# EAGLE design vibe-controller (EAGLE 9.6.2)
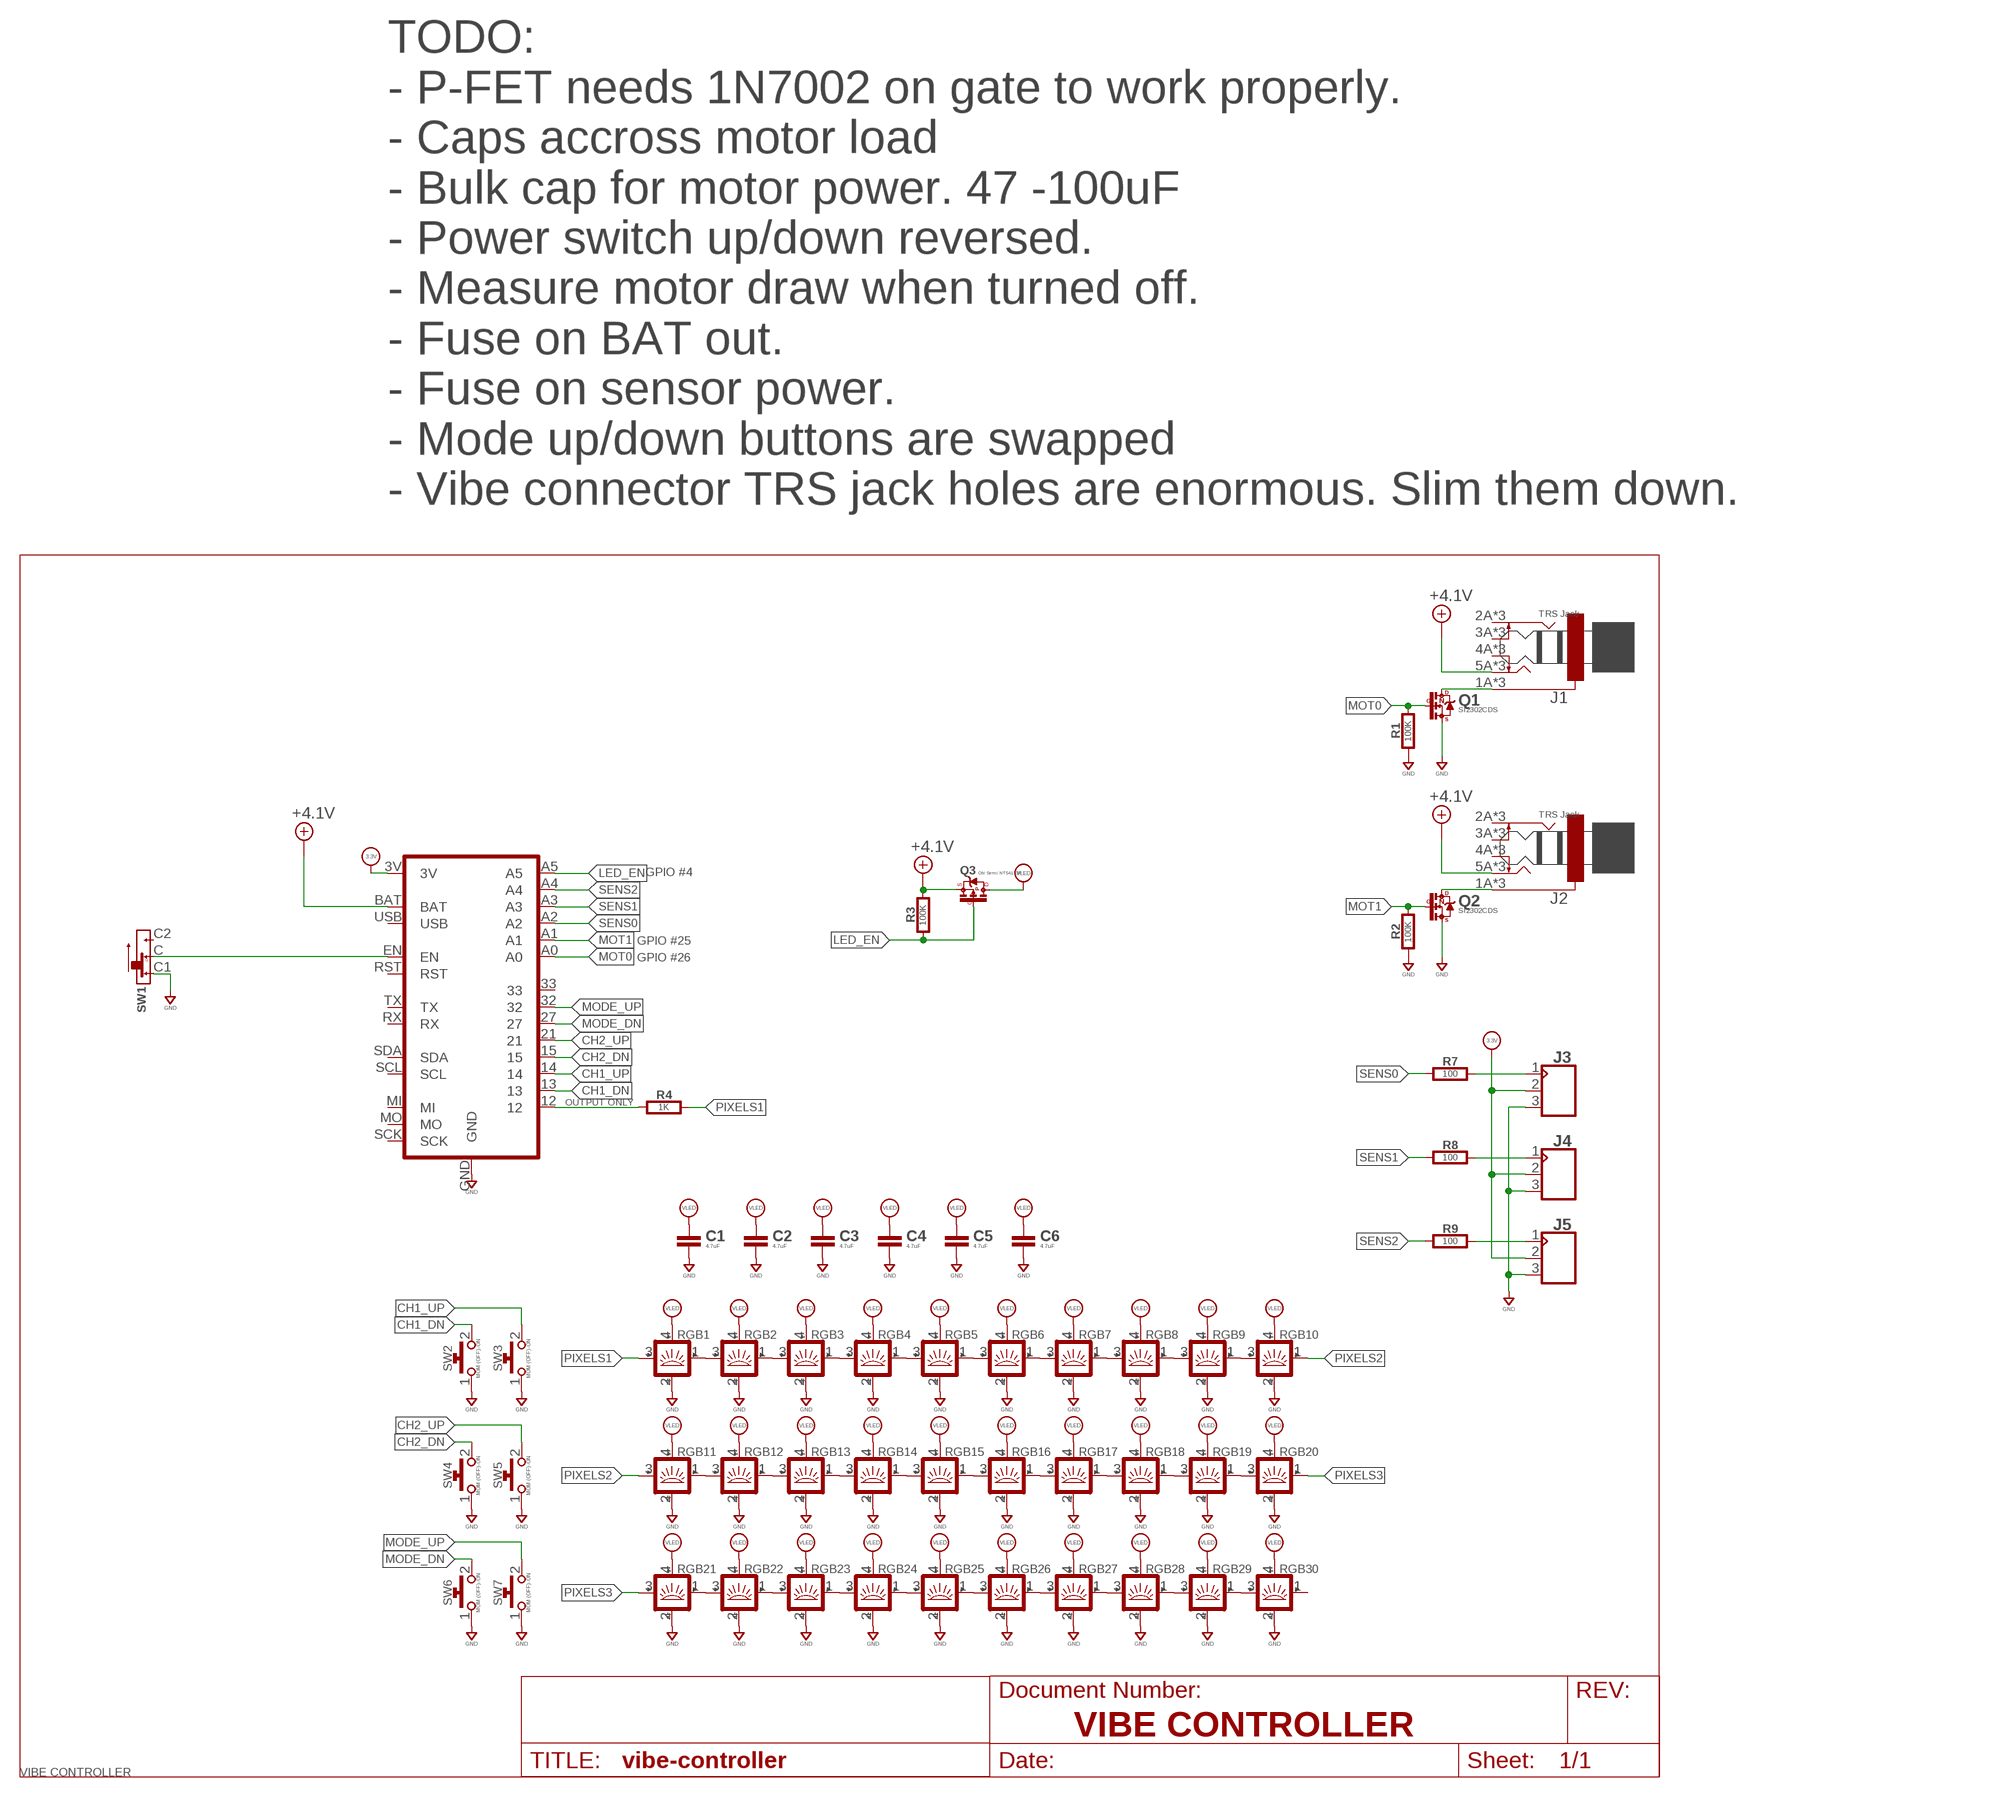
[diagram p0: schematic, sheet 1]
FRAME1 (LETTER_L): DOCUMENT_NUMBER: VIBE CONTROLLER

## Parts
C1  4.7uF  CAPACITOR0603  [0603-CAP]
C2  4.7uF  CAPACITOR0603  [0603-CAP]
C3  4.7uF  CAPACITOR0603  [0603-CAP]
C4  4.7uF  CAPACITOR0603  [0603-CAP]
C5  4.7uF  CAPACITOR0603  [0603-CAP]
C6  4.7uF  CAPACITOR0603  [0603-CAP]
HUZ1  HUZZAHHUZZAH  [ADAFRUIT_HUZZAH32]
J1  TRS Jack  TRS-JACK-STEREOPJ-324  [PJ-324]
J2  TRS Jack  TRS-JACK-STEREOPJ-324  [PJ-324]
J3  CON_03X1-2.54MM-THD-RA  [MA03X1-RA-THD]
J4  CON_03X1-2.54MM-THD-RA  [MA03X1-RA-THD]
J5  CON_03X1-2.54MM-THD-RA  [MA03X1-RA-THD]
Q1  SI2302CDS  N-FET_SI2302  [SOT-23]
Q2  SI2302CDS  N-FET_SI2302  [SOT-23]
Q3  ON Semi NTS4173P  P-FETSOT-323  [SOT-323]
R1  100K  RESISTOR0603  [0603-RES]
R2  100K  RESISTOR0603  [0603-RES]
R3  100K  RESISTOR0603  [0603-RES]
R4  1K  RESISTOR0603  [0603-RES]
R7  100  RESISTOR0603  [0603-RES]
R8  100  RESISTOR0603  [0603-RES]
R9  100  RESISTOR0603  [0603-RES]
RGB1  SMART_LED3535  [SMD_3535]
RGB2  SMART_LED3535  [SMD_3535]
RGB3  SMART_LED3535  [SMD_3535]
RGB4  SMART_LED3535  [SMD_3535]
RGB5  SMART_LED3535  [SMD_3535]
RGB6  SMART_LED3535  [SMD_3535]
RGB7  SMART_LED3535  [SMD_3535]
RGB8  SMART_LED3535  [SMD_3535]
RGB9  SMART_LED3535  [SMD_3535]
RGB10  SMART_LED3535  [SMD_3535]
RGB11  SMART_LED3535  [SMD_3535]
RGB12  SMART_LED3535  [SMD_3535]
RGB13  SMART_LED3535  [SMD_3535]
RGB14  SMART_LED3535  [SMD_3535]
RGB15  SMART_LED3535  [SMD_3535]
RGB16  SMART_LED3535  [SMD_3535]
RGB17  SMART_LED3535  [SMD_3535]
RGB18  SMART_LED3535  [SMD_3535]
RGB19  SMART_LED3535  [SMD_3535]
RGB20  SMART_LED3535  [SMD_3535]
RGB21  SMART_LED3535  [SMD_3535]
RGB22  SMART_LED3535  [SMD_3535]
RGB23  SMART_LED3535  [SMD_3535]
RGB24  SMART_LED3535  [SMD_3535]
RGB25  SMART_LED3535  [SMD_3535]
RGB26  SMART_LED3535  [SMD_3535]
RGB27  SMART_LED3535  [SMD_3535]
RGB28  SMART_LED3535  [SMD_3535]
RGB29  SMART_LED3535  [SMD_3535]
RGB30  SMART_LED3535  [SMD_3535]
SW1  SLIDE-SPDT-SSSS  [ALPS_SSSS810701]
SW2  MOM (OFF)-ON  TACTILE-2PSMD  [SWITCH-0635-2P-SMD]
SW3  MOM (OFF)-ON  TACTILE-2PSMD  [SWITCH-0635-2P-SMD]
SW4  MOM (OFF)-ON  TACTILE-2PSMD  [SWITCH-0635-2P-SMD]
SW5  MOM (OFF)-ON  TACTILE-2PSMD  [SWITCH-0635-2P-SMD]
SW6  MOM (OFF)-ON  TACTILE-2PSMD  [SWITCH-0635-2P-SMD]
SW7  MOM (OFF)-ON  TACTILE-2PSMD  [SWITCH-0635-2P-SMD]

## Nets
+3.3V: HUZ1.3V J3.2 J4.2 J5.2 ; supply symbol labelled 3.3V
+4.1V: HUZ1.BAT J1.5A1(T) J1.5A2(T) J1.5A(T) J2.5A1(T) J2.5A2(T) J2.5A(T) Q3.2(S) R3.2
CH1_DN: HUZ1.13 SW2.2
CH1_UP: HUZ1.14 SW3.2
CH2_DN: HUZ1.15 SW4.2
CH2_UP: HUZ1.21 SW5.2
GND: C1.2 C2.2 C3.2 C4.2 C5.2 C6.2 HUZ1.GND J3.3 J4.3 J5.3 Q1.2(S) Q2.2(S) R1.1 R2.1 RGB1.2(GND) RGB2.2(GND) RGB3.2(GND) RGB4.2(GND) RGB5.2(GND) RGB6.2(GND) RGB7.2(GND) RGB8.2(GND) RGB9.2(GND) RGB10.2(GND) RGB11.2(GND) RGB12.2(GND) RGB13.2(GND) RGB14.2(GND) RGB15.2(GND) RGB16.2(GND) RGB17.2(GND) RGB18.2(GND) RGB19.2(GND) RGB20.2(GND) RGB21.2(GND) RGB22.2(GND) RGB23.2(GND) RGB24.2(GND) RGB25.2(GND) RGB26.2(GND) RGB27.2(GND) RGB28.2(GND) RGB29.2(GND) RGB30.2(GND) SW1.C1 SW2.1 SW3.1 SW4.1 SW5.1 SW6.1 SW7.1
LED_EN: HUZ1.A5 Q3.1(G) R3.1
MODE_DN: HUZ1.27 SW6.2
MODE_UP: HUZ1.32 SW7.2
MOT0: HUZ1.A0 Q1.1(G) R1.2
MOT1: HUZ1.A1 Q2.1(G) R2.2
N$1: HUZ1.EN SW1.C
N$2: J1.1A1(S) J1.1A2(S) J1.1A(S) Q1.3(D)
N$4: J2.1A1(S) J2.1A2(S) J2.1A(S) Q2.3(D)
N$5: RGB11.1(OUT) RGB12.3(IN)
N$6: RGB1.1(OUT) RGB2.3(IN)
N$7: RGB2.1(OUT) RGB3.3(IN)
N$8: RGB3.1(OUT) RGB4.3(IN)
N$9: RGB4.1(OUT) RGB5.3(IN)
N$10: RGB5.1(OUT) RGB6.3(IN)
N$11: RGB6.1(OUT) RGB7.3(IN)
N$12: RGB7.1(OUT) RGB8.3(IN)
N$13: RGB8.1(OUT) RGB9.3(IN)
N$14: RGB9.1(OUT) RGB10.3(IN)
N$15: RGB12.1(OUT) RGB13.3(IN)
N$16: RGB13.1(OUT) RGB14.3(IN)
N$17: RGB14.1(OUT) RGB15.3(IN)
N$18: RGB15.1(OUT) RGB16.3(IN)
N$19: RGB16.1(OUT) RGB17.3(IN)
N$20: RGB17.1(OUT) RGB18.3(IN)
N$21: RGB18.1(OUT) RGB19.3(IN)
N$22: RGB19.1(OUT) RGB20.3(IN)
N$23: RGB21.1(OUT) RGB22.3(IN)
N$24: RGB22.1(OUT) RGB23.3(IN)
N$25: RGB23.1(OUT) RGB24.3(IN)
N$26: RGB24.1(OUT) RGB25.3(IN)
N$27: RGB25.1(OUT) RGB26.3(IN)
N$28: RGB26.1(OUT) RGB27.3(IN)
N$29: RGB27.1(OUT) RGB28.3(IN)
N$30: RGB28.1(OUT) RGB29.3(IN)
N$31: RGB29.1(OUT) RGB30.3(IN)
N$32: HUZ1.12 R4.1
N$35: J3.1 R7.2
N$36: J4.1 R8.2
N$37: J5.1 R9.2
PIXELS1: R4.2 RGB1.3(IN)
PIXELS2: RGB10.1(OUT) RGB11.3(IN)
PIXELS3: RGB20.1(OUT) RGB21.3(IN)
SENS0: HUZ1.A2 R7.1
SENS1: HUZ1.A3 R8.1
SENS2: HUZ1.A4 R9.1
VLED: C1.1 C2.1 C3.1 C4.1 C5.1 C6.1 Q3.3(D) RGB1.4(VDD) RGB2.4(VDD) RGB3.4(VDD) RGB4.4(VDD) RGB5.4(VDD) RGB6.4(VDD) RGB7.4(VDD) RGB8.4(VDD) RGB9.4(VDD) RGB10.4(VDD) RGB11.4(VDD) RGB12.4(VDD) RGB13.4(VDD) RGB14.4(VDD) RGB15.4(VDD) RGB16.4(VDD) RGB17.4(VDD) RGB18.4(VDD) RGB19.4(VDD) RGB20.4(VDD) RGB21.4(VDD) RGB22.4(VDD) RGB23.4(VDD) RGB24.4(VDD) RGB25.4(VDD) RGB26.4(VDD) RGB27.4(VDD) RGB28.4(VDD) RGB29.4(VDD) RGB30.4(VDD)
Unconnected: HUZ1.33 HUZ1.MI HUZ1.MO HUZ1.RST HUZ1.RX HUZ1.SCK HUZ1.SCL HUZ1.SDA HUZ1.TX HUZ1.USB J1.2A1(R) J1.2A2(R) J1.2A(R) J1.3A1(RN) J1.3A2(RN) J1.3A(RN) J1.4A1(TN) J1.4A2(TN) J1.4A(TN) J2.2A1(R) J2.2A2(R) J2.2A(R) J2.3A1(RN) J2.3A2(RN) J2.3A(RN) J2.4A1(TN) J2.4A2(TN) J2.4A(TN) RGB30.1(OUT) SW1.C2

## Notes on the sheet
- TODO:
  - P-FET needs 1N7002 on gate to work properly.
  - Caps accross motor load
  - Bulk cap for motor power. 47 -100uF
  - Power switch up/down reversed.
  - Measure motor draw when turned off.
  - Fuse on BAT out.
  - Fuse on sensor power.
  - Mode up/down buttons are swapped
  - Vibe connector TRS jack holes are enormous. Slim them down.
- GPIO #4
- GPIO #25
- GPIO #26
- OUTPUT ONLY

## Library data of the parts
C1-C6 = rlc:CAPACITOR: Capacitor
HUZ1 = co-espressif:HUZZAH: AdaFruit Huzzah32
J1 J2 = con-trs:TRS-JACK-STEREO: TRS Jack; COST01: 0.18; COST10: 0.18; COST100: 0.18; MFR: Tayda; MPN: A-4780
J3-J5 = con-headers:CON_03X1: Header, 3-pin, single row
Q1 Q2 = transistor-fet:N-FET: FET
Q3 = transistor-fet:P-FET: P-FET (PFET)
R1-R4 R7-R9 = rlc:RESISTOR: Resistor
RGB1-RGB30 = led:SMART_LED: Smart LED SK6812 WS2812
SW1 = switch-smd:SLIDE-SPDT: Slide Switch - SPDT; MFR: Alps; MPN: SSSS810701
SW2-SW7 = switch-smd:TACTILE-2P: Tactile Push Switch; MFR: CK Switch; MPN: PTS635S*SMTR; MPN2: Pololu #1400

## Board
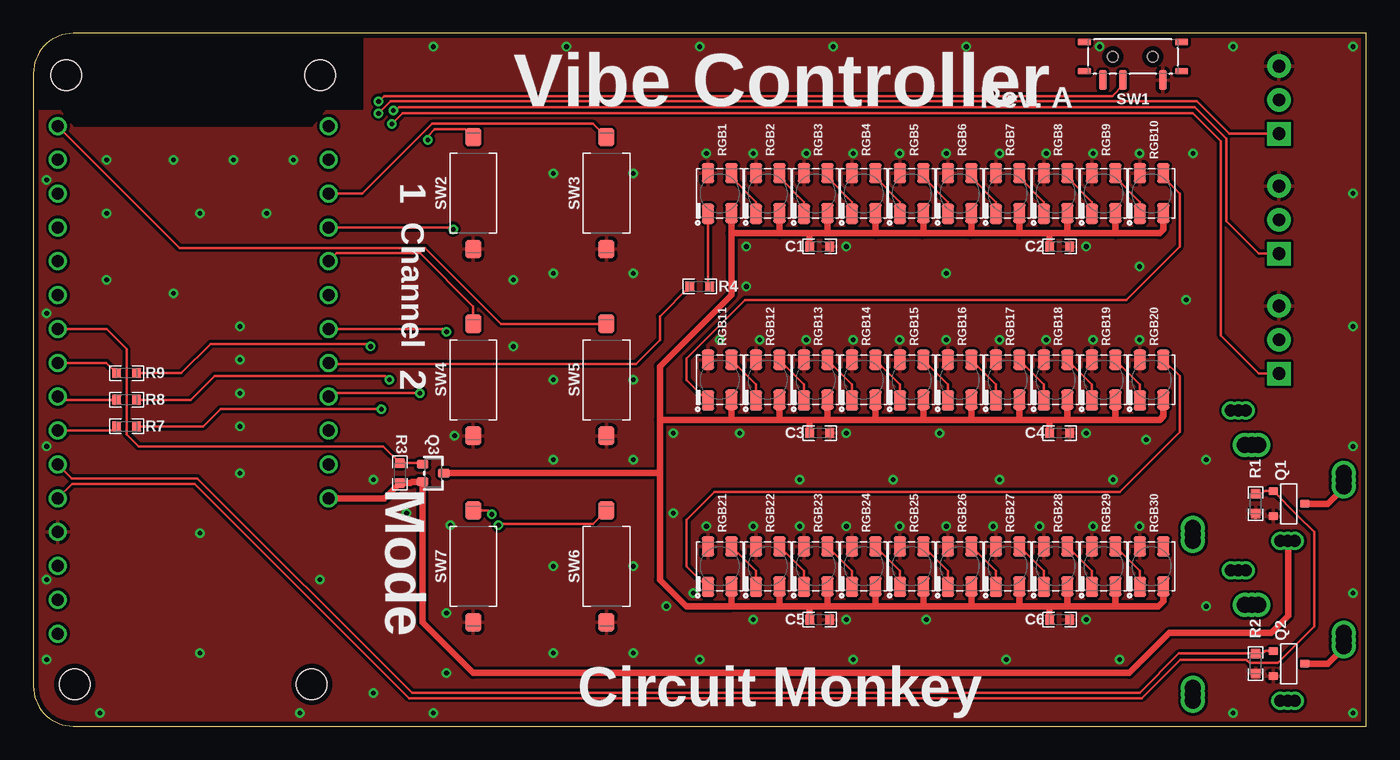
[diagram p1: board, top side]
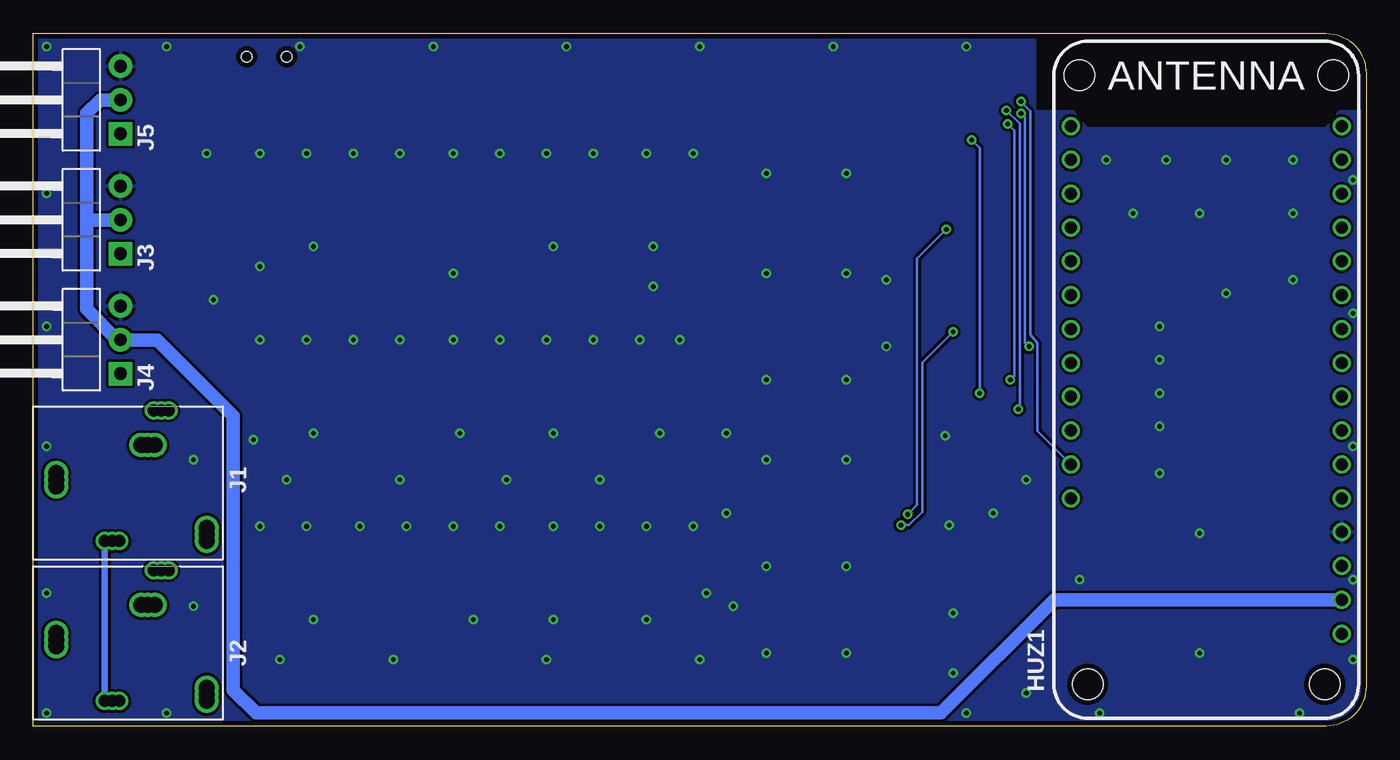
[diagram p2: board, bottom side, seen from below]

Size 100 x 52 mm. Coordinates in mm from the lower left corner, seen from the top.
Outline: 3,0 100,0 100,52 3,52 arc90 0,49 0,3 arc90 3,0
Copper layers (1*16): Top 0.0356mm / dielectric 1.5011mm / Bottom 0.0356mm
Design rules "OSH-CircuitMonkey *": minimum track width 6mil, minimum drill 13mil, track to track 0.2mm, track to pad 6mil, pad to pad 6mil, via to via 6mil, smd to smd 6mil, copper to edge 15mil, drill to drill 6mil, minimum pad ring 7mil, minimum via ring 7mil, stop-mask expansion 3mil, vias tented up to drill 13mil, thermal gap 10mil

### Footprints (pad centres in the part's own frame; a part is rotated, then mirrored left to right if it is on the bottom)
0603-CAP = smd 0.711 x 0.762: 1 -0.752,0; 2 0.752,0
ADAFRUIT_HUZZAH32 = drill 0.9: 3V -16.51,-10.16; 12 1.27,10.16; 13 -1.27,10.16; 14 13.97,10.16; 15 8.89,10.16; 21 19.05,-10.16; 27 3.81,10.16; 32 11.43,10.16; 33 6.35,10.16; A0 -8.89,-10.16; A1 -6.35,-10.16; A2 -3.81,-10.16; A3 -1.27,-10.16; A4 1.27,-10.16; A5 3.81,-10.16; BAT -8.89,10.16; EN -6.35,10.16; GND -11.43,-10.16; MI 11.43,-10.16; MO 8.89,-10.16; NC -13.97,-10.16; RST -19.05,-10.16; RX 13.97,-10.16; SCK 6.35,-10.16; SCL 16.51,10.16; SDA 19.05,10.16; TX 16.51,-10.16; USB -3.81,10.16 | hole 2.286: -22.86,8.89; 22.86,9.525; 22.86,-9.525; -22.86,-8.89
PJ-324 = drill 1.2: 1A 0,-1.7; 1A1 -0.5,-1.7; 1A2 0.5,-1.7; 3A 2.6,-8.6; 3A1 2.6,-8.1; 3A2 2.6,-9.1; 4A -4.1,-13; 4A1 -4.6,-13; 4A2 -3.6,-13 | drill 0.9: 2A 5.2,-9.6; 2A1 5.2,-9.05; 2A2 5.2,-10.15; 5A -4.6,-5.9; 5A1 -4.6,-5.35; 5A2 -4.6,-6.45
MA03X1-RA-THD = drill 0.965 pad 1.778 square: 1 -2.54,-2.54 | drill 0.965 pad 1.778: 2 0,-2.54; 3 2.54,-2.54
SOT-23 = smd 0.6 x 0.7: 1 -0.95,-1.18; 2 0.95,-1.18; 3 0,1.18
SOT-323 = smd 0.7 x 0.9: 1 -0.65,-0.8; 2 0.65,-0.8; 3 0,0.8
0603-RES = smd 0.711 x 0.762: 1 -0.752,0; 2 0.752,0
SMD_3535 = smd 1.5 x 0.9: 1 -1.5,0.875; 2 -1.5,-0.875; 3 1.55,-0.875; 4 1.5,0.875
ALPS_SSSS810701 = smd 0.6 x 1.5: C 0.75,1.75; C1 -2.25,1.75; C2 2.25,1.75 | smd 1 x 0.5: MT1 -3.65,-1.1; MT2 -3.65,1.1; MT3 3.65,1.1; MT4 3.65,-1.1 | hole 0.8: -1.5,0; 1.5,0
SWITCH-0635-2P-SMD = smd 1.4 x 1.2: 1 -4.2,0; 2 4.2,0

### Placement (x,y rotation side)
C1  59,36 0 top
C2  77,36 0 top
C3  59,22 0 top
C4  77,22 0 top
C5  59,8 0 top
C6  77,8 0 top
HUZ1  12,26 90 bottom
J1  100,18.5 90 bottom
J2  100,6.5 90 bottom
J3  96,38 90 bottom
J4  96,29 90 bottom
J5  96,47 90 bottom
Q1  94.2,16.7 270 top
Q2  94.2,4.7 270 top
Q3  30,19 270 top
R1  91.7,16.7 90 top
R2  91.7,4.7 90 top
R3  27.5,19 270 top
R4  50,33 0 top
R7  7,22.5 0 top
R8  7,24.5 0 top
R9  7,26.5 0 top
RGB1  51.5,40 270 top
RGB2  55.1,40 270 top
RGB3  58.7,40 270 top
RGB4  62.3,40 270 top
RGB5  65.9,40 270 top
RGB6  69.5,40 270 top
RGB7  73.1,40 270 top
RGB8  76.7,40 270 top
RGB9  80.3,40 270 top
RGB10  83.9,40 270 top
RGB11  51.5,26 270 top
RGB12  55.1,26 270 top
RGB13  58.7,26 270 top
RGB14  62.3,26 270 top
RGB15  65.9,26 270 top
RGB16  69.5,26 270 top
RGB17  73.1,26 270 top
RGB18  76.7,26 270 top
RGB19  80.3,26 270 top
RGB20  83.9,26 270 top
RGB21  51.5,12 270 top
RGB22  55.1,12 270 top
RGB23  58.7,12 270 top
RGB24  62.3,12 270 top
RGB25  65.9,12 270 top
RGB26  69.5,12 270 top
RGB27  73.1,12 270 top
RGB28  76.7,12 270 top
RGB29  80.3,12 270 top
RGB30  83.9,12 270 top
SW1  82.5,50.25 180 top
SW2  33,40 90 top
SW3  43,40 90 top
SW4  33,26 90 top
SW5  43,26 90 top
SW6  43,12 90 top
SW7  33,12 90 top

### Tracks (layer width: path | path; a pad name or v marks a point on that pad's centre or on a via)
+3.3V
  Bottom 1: HUZ1.3V 23.41,9.49 31.9,1 83.3,1 85,2.7 85,23.3 90.7,29 J4.2 93.7,29 96,31.3 96,38 | J3.2 96,38 | J5.2 95,47 96,46 96,38
+4.1V
  Top 0.5: HUZ1.BAT 26.36,17.11 R3.2 28.3,18.25 28.4,18.35 Q3.2 29.2,7.8 33,4 82.22,4 85.22,7 92.88,7 94.15,8.28 94.15,13.9 J1.5A1 J1.5A2 J1.5A
  Bottom 0.5: J1.5A1 94.65,2.45 J2.5A | J2.5A J2.5A1 | J2.5A J2.5A2
CH1_DN  (via drill 0.35)
  Top 0.2: HUZ1.13 22.43,25 v29,25 | v29.6,44 29.6,44.3 30.1,44.8 32.4,44.8 SW2.2
  Bottom 0.2: v29,25 29,43.4 v29.6,44
CH1_UP
  Top 0.2: SW3.2 42,45.2 29.9,45.2 24.67,39.97 HUZ1.14
CH2_DN
  Top 0.2: SW4.2 33,31.49 29,35.49 22.76,35.49 HUZ1.15
CH2_UP
  Top 0.2: SW5.2 35.1,30.2 29.4,35.9 10.99,35.9 HUZ1.21
GND  (via drill 0.35)
  other vias: 99,1 90,1 99,10 99,21 99,30 99,40 99,51 90,51 80,51 70,51 60,51 50,51 40,51 30,51 1,31 1,41 1,21 1,11 1,5 5,1 20,1 30,1 50.5,43 54,43 58,43 61.5,43 65,43 68.5,43 72.5,43 76,43 79.5,43 83,43 79,36 83,34.5 61,36 68.5,34 53.5,36 53.5,33 51.5,29 54.5,29 58,29 61.5,29 65,29 68.5,29 72.5,29 76,29 79.5,29 83,29 79,22 83.5,21.5 81,18.5 72.5,18.5 68,22 64.5,18.5 61,22 57.5,18.5 53,22 48,22 48,16 49.5,10 50.5,15 54,15 57.5,15 61,15 65,15 68.5,15 72,15 75.5,15 79.5,15 83,15 61,8 79,8 81.5,5 88,9 73,5 67,8 61.5,5 54,8 50,5 47.5,9 45,5.5 39,5.5 45,12 39,12 45,20 39,20 45,26 39,26 45,34 39,34 36,28.5 36,33.5 45,41.5 39,41.5 31.6,21.8 31.3,15.1 31,8.5 28,16 25.5,18.5 31,4 25.5,2.5 15.5,19 15.5,22.5 15.5,25 15.5,27.5 15.5,30 17.5,38.5 12.5,38.5 15,42.5 5.5,42.5 10.5,42.5 19.5,42.5 5.5,38.5 5.5,33.5 10.5,32.5 86.5,32 88,20 87,43 12.5,5.5 12.5,14.5 21.5,11
  pour Bottom: 0,0 100,0 100,52 0,52
  pour Top: 0,0 100,0 100,52 0,52
LED_EN
  Top 0.2: Q3.1 29.1,19.75 R3.1 26.25,21 7.9,21 7,21.9 7,28.3 5.49,29.81 HUZ1.A5
MODE_DN  (via drill 0.35)
  Top 0.2: HUZ1.27 30.79,29.81 v31,29.6 | v34.9,15.1 35,15.2 42,15.2 SW6.2
  Bottom 0.2: v31,29.6 33.3,27.3 33.3,16.1 34.3,15.1 v34.9,15.1
MODE_UP  (via drill 0.35)
  Top 0.2: HUZ1.32 31.37,37.43 v31.5,37.3 | v34.4,15.9 34.1,16.2 SW7.2
  Bottom 0.2: v31.5,37.3 33.7,35.1 33.7,16.6 v34.4,15.9
MOT0
  Top 0.2: R1.2 92.2,17.45 92.4,17.65 Q1.1 94.83,15.84 96.1,14.57 96.1,7.48 93.37,4.74 91.26,4.74 91,5 86.07,5 83.17,2.1 28.2,2.1 12.1,18.2 2.9,18.2 1.84,17.14 HUZ1.A0
MOT1
  Top 0.2: Q2.1 92.42,5.65 92.22,5.45 R2.2 85.95,5.45 83,2.5 28.4,2.5 12.3,18.6 2.89,18.6 HUZ1.A1
N$1  (via drill 0.35)
  Top 0.2: SW1.C 81.75,48.1 80.95,47.3 26.3,47.3 v25.9,46.9
  Bottom 0.2: HUZ1.EN 24.66,22.15 24.66,28.75 25.2,29.39 25.2,46.16 25.9,46.87 v25.9,46.9
N$2
  Top 0.5: Q1.3 97.1,16.7 98.3,17.9 J1.1A1 J1.1A J1.1A2
N$4
  Top 0.5: J2.1A 98.3,5.9 97.1,4.7 Q2.3 | J2.1A J2.1A1 | J2.1A J2.1A2
N$5
  Top 0.2: RGB11.1 54.23,25.65 RGB12.3
N$6
  Top 0.2: RGB1.1 52.38,41.2 54.23,39.35 RGB2.3
N$7
  Top 0.2: RGB2.1 55.98,41.2 57.83,39.35 RGB3.3
N$8
  Top 0.2: RGB3.1 59.58,41.2 61.42,39.35 RGB4.3
N$9
  Top 0.2: RGB4.1 63.17,41.2 65.03,39.35 RGB5.3
N$10
  Top 0.2: RGB5.1 66.78,41.2 68.62,39.35 RGB6.3
N$11
  Top 0.2: RGB6.1 70.38,41.2 72.22,39.35 RGB7.3
N$12
  Top 0.2: RGB7.1 73.97,41.2 75.83,39.35 RGB8.3
N$13
  Top 0.2: RGB8.1 77.58,41.2 79.42,39.35 RGB9.3
N$14
  Top 0.2: RGB9.1 81.17,41.2 83.03,39.35 RGB10.3
N$15
  Top 0.2: RGB12.1 57.83,25.65 RGB13.3
N$16
  Top 0.2: RGB13.1 61.42,25.65 RGB14.3
N$17
  Top 0.2: RGB14.1 65.03,25.65 RGB15.3
N$18
  Top 0.2: RGB15.1 68.62,25.65 RGB16.3
N$19
  Top 0.2: RGB16.1 72.22,25.65 RGB17.3
N$20
  Top 0.2: RGB17.1 75.83,25.65 RGB18.3
N$21
  Top 0.2: RGB18.1 79.42,25.65 RGB19.3
N$22
  Top 0.2: RGB19.1 83.03,25.65 RGB20.3
N$23
  Top 0.2: RGB21.1 54.23,11.65 RGB22.3
N$24
  Top 0.2: RGB22.1 57.83,11.65 RGB23.3
N$25
  Top 0.2: RGB23.1 61.42,11.65 RGB24.3
N$26
  Top 0.2: RGB24.1 65.03,11.65 RGB25.3
N$27
  Top 0.2: RGB25.1 68.62,11.65 RGB26.3
N$28
  Top 0.2: RGB26.1 72.22,11.65 RGB27.3
N$29
  Top 0.2: RGB27.1 75.83,11.65 RGB28.3
N$30
  Top 0.2: RGB28.1 79.42,11.65 RGB29.3
N$31
  Top 0.2: RGB29.1 83.03,11.65 RGB30.3
N$32
  Top 0.2: R4.1 47,30.75 47,29 45.2,27.2 22.23,27.2 HUZ1.12
N$35  (via drill 0.35)
  Top 0.2: J3.1 91.96,35.46 89.5,37.92 89.5,44.1 87.15,46.45 27.44,46.45 27.18,46.2 v27,46.2 | R7.2 12.75,22.5 14.05,23.8 v26.1,23.8
  Bottom 0.2: v26.1,23.8 26,23.9 26,45.2 v27,46.2
N$36  (via drill 0.35)
  Top 0.2: J4.1 91.96,26.46 89.1,29.32 89.1,43.9 87,46 27.7,46 v26.9,45.2 | R8.2 11.8,24.5 13.6,26.3 26.4,26.3 v26.7,26
  Bottom 0.2: v26.7,26 26.4,26.3 26.4,44.7 v26.9,45.2
N$37  (via drill 0.35)
  Top 0.2: J5.1 89.74,44.46 87.3,46.9 26.8,46.9 v25.9,46 | R9.2 11.1,26.5 13.3,28.7 25.1,28.7 v25.3,28.5
  Bottom 0.2: v25.3,28.5 25.6,28.8 25.6,45.7 v25.9,46
PIXELS1
  Top 0.2: RGB1.3 50.62,33.13 R4.2
PIXELS2
  Top 0.2: RGB10.1 84.78,41.2 86,39.98 86,36 82,32 53.4,32 49,27.6 49,26 50.55,24.45 RGB11.3
PIXELS3
  Top 0.2: RGB20.1 86,26.27 86,22.1 81.5,17.6 51.1,17.6 49,15.5 49,12 50.55,10.45 RGB21.3
SENS0
  Top 0.2: HUZ1.A2 5.94,22.19 R7.1
SENS1
  Top 0.2: R8.1 2.07,24.5 HUZ1.A3
SENS2
  Top 0.2: R9.1 5.48,27.27 HUZ1.A4
VLED
  Top 0.5: RGB20.4 84.78,23.27 84.5,23 81.2,23 | 81.2,23 77.6,23 | 77.6,23 76.2,23 | 76.2,23 73.9,23 | 73.9,23 70.4,23 | 70.4,23 66.7,23 | 66.7,23 63.1,23 | 63.1,23 59.7,23 | 59.7,23 58.2,23 | 58.2,23 56,23 | RGB10.4 84.78,37.27 84.5,37 81.2,37 | 81.2,37 77.6,37 | 77.6,37 76.2,37 | 76.2,37 74,37 | 74,37 70.3,37 | 70.3,37 66.7,37 | 66.7,37 63.2,37 | 63.2,37 59.6,37 | 59.6,37 58.3,37 | 58.3,37 56,37 | RGB30.4 84.78,9.38 84.4,9 81.2,9 | 81.2,9 77.6,9 | 77.6,9 76.2,9 | 76.2,9 73.9,9 | 73.9,9 70.3,9 | 70.3,9 66.8,9 | 66.8,9 63.2,9 | 63.2,9 59.6,9 | 59.6,9 58.3,9 | 58.3,9 56,9 | 56,9 52.38,9 | RGB29.4 81.17,9.03 81.2,9 | RGB28.4 77.58,9.03 77.6,9 | RGB27.4 73.97,9.07 73.9,9 | RGB26.4 70.38,9.07 70.3,9 | RGB25.4 66.78,9.03 66.8,9 | RGB24.4 63.17,9.03 63.2,9 | RGB23.4 59.58,9.03 59.6,9 | RGB22.4 55.98,9.03 56,9 | RGB19.4 81.17,23.02 81.2,23 | RGB18.4 77.58,23.02 77.6,23 | RGB17.4 73.97,23.07 73.9,23 | RGB16.4 70.38,23.02 70.4,23 | RGB15.4 66.78,23.07 66.7,23 | RGB14.4 63.17,23.07 63.1,23 | RGB13.4 59.58,23.12 59.7,23 | RGB12.4 55.98,23.02 56,23 | RGB9.4 81.17,37.02 81.2,37 | RGB8.4 77.58,37.02 77.6,37 | RGB7.4 73.97,37.02 74,37 | RGB6.4 70.38,37.08 70.3,37 | RGB5.4 66.78,37.08 66.7,37 | RGB4.4 63.17,37.02 63.2,37 | RGB3.4 59.58,37.02 59.6,37 | RGB2.4 55.98,37.02 56,37 | C6.1 76.25,8.95 76.2,9 | C5.1 58.25,8.95 58.3,9 | C3.1 58.25,22.95 58.2,23 | C4.1 76.25,22.95 76.2,23 | C2.1 76.25,36.95 76.2,37 | C1.1 58.25,36.95 58.3,37 | 52.38,9 49,9 47,11 47,19 | Q3.3 47,19 | RGB21.4 52.38,9 | RGB1.4 52.38,37 | 52.38,37 52.38,32.38 47,27 47,23 | 56,37 52.38,37 | 47,23 47,19 | 56,23 52.4,23 | 52.4,23 47,23 | RGB11.4 52.38,23.02 52.4,23

### Text on the board
tPlace: Rev. A | Vibe Controller | 1 | Channel | 2 | Mode | Circuit Monkey